# EAGLE design MIDI-Patchbay-Shield (EAGLE 8.4.2)
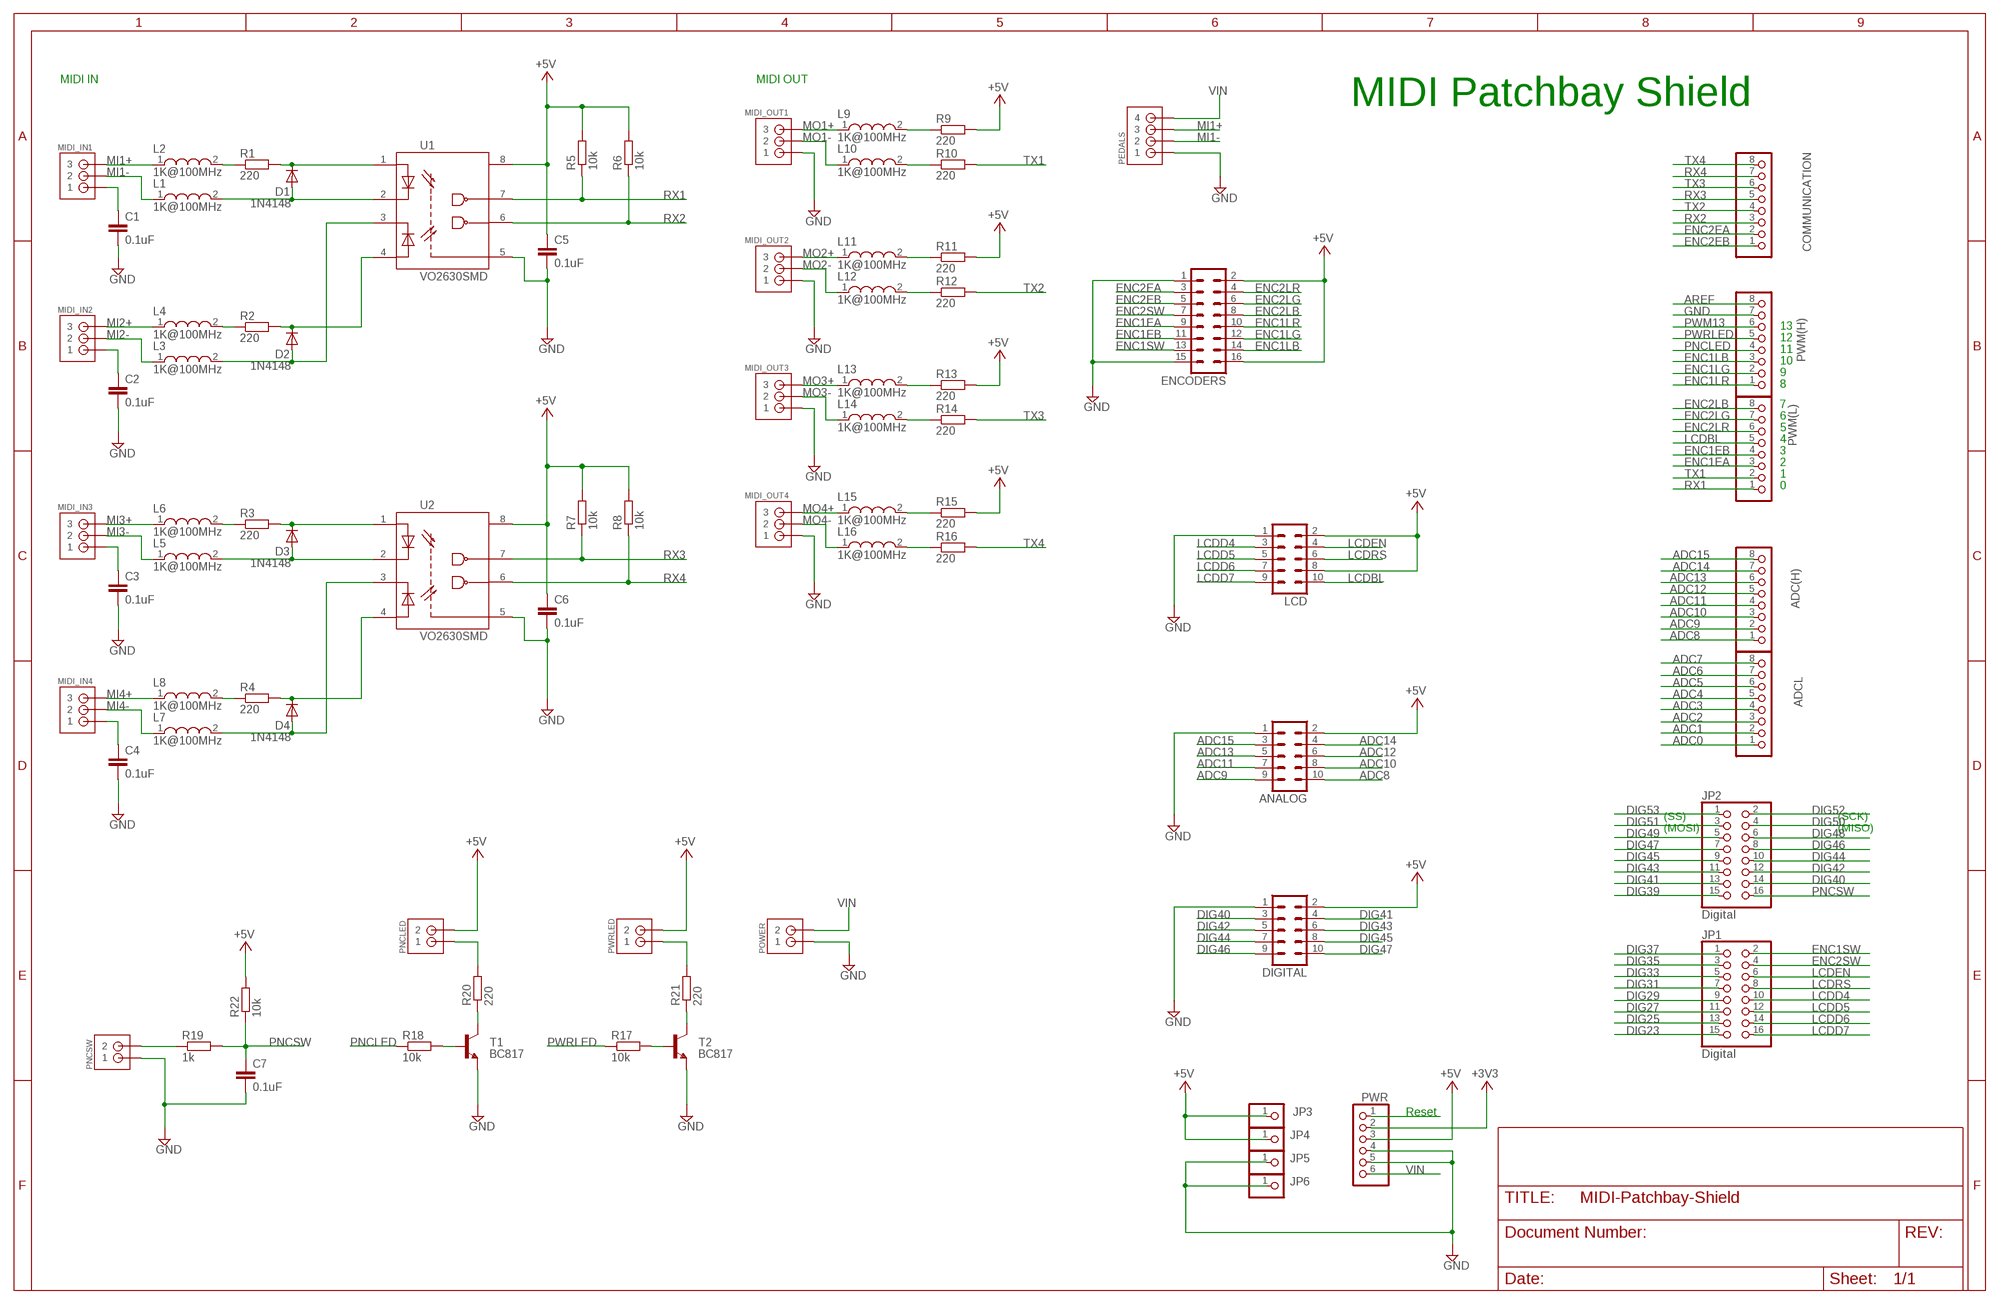
[diagram p0: schematic, sheet 1]

## Parts
ADC(H)  PINHD-1X8  [1X08]
ADCL  PINHD-1X8  [1X08]
ANALOG  ML10  [ML10]
C1  0.1uF  CAP0805  [0805]
C2  0.1uF  CAP0805  [0805]
C3  0.1uF  CAP0805  [0805]
C4  0.1uF  CAP0805  [0805]
C5  0.1uF  C-EUC0805  [C0805]
C6  0.1uF  C-EUC0805  [C0805]
C7  0.1uF  CAP0805  [0805]
COMMUNICATION  PINHD-1X8  [1X08]
D1  1N4148  [SOD323-W]
D2  1N4148  [SOD323-W]
D3  1N4148  [SOD323-W]
D4  1N4148  [SOD323-W]
DIGITAL  ML10  [ML10]
ENCODERS  ML16  [ML16]
JP1  Digital  PINHD-2X8  [2X08]
JP2  Digital  PINHD-2X8  [2X08]
JP3  PINHD-1X1  [1X01]
JP4  PINHD-1X1  [1X01]
JP5  PINHD-1X1  [1X01]
JP6  PINHD-1X1  [1X01]
L1  1K@100MHz  WE-RFI_0805  [WE-RFI_0805]
L2  1K@100MHz  WE-RFI_0805  [WE-RFI_0805]
L3  1K@100MHz  WE-RFI_0805  [WE-RFI_0805]
L4  1K@100MHz  WE-RFI_0805  [WE-RFI_0805]
L5  1K@100MHz  WE-RFI_0805  [WE-RFI_0805]
L6  1K@100MHz  WE-RFI_0805  [WE-RFI_0805]
L7  1K@100MHz  WE-RFI_0805  [WE-RFI_0805]
L8  1K@100MHz  WE-RFI_0805  [WE-RFI_0805]
L9  1K@100MHz  WE-RFI_0805  [WE-RFI_0805]
L10  1K@100MHz  WE-RFI_0805  [WE-RFI_0805]
L11  1K@100MHz  WE-RFI_0805  [WE-RFI_0805]
L12  1K@100MHz  WE-RFI_0805  [WE-RFI_0805]
L13  1K@100MHz  WE-RFI_0805  [WE-RFI_0805]
L14  1K@100MHz  WE-RFI_0805  [WE-RFI_0805]
L15  1K@100MHz  WE-RFI_0805  [WE-RFI_0805]
L16  1K@100MHz  WE-RFI_0805  [WE-RFI_0805]
LCD  ML10  [ML10]
MIDI_IN1  JST-XA-03-PIN  [JST-XA-03]
MIDI_IN2  JST-XA-03-PIN  [JST-XA-03]
MIDI_IN3  JST-XA-03-PIN  [JST-XA-03]
MIDI_IN4  JST-XA-03-PIN  [JST-XA-03]
MIDI_OUT1  JST-XA-03-PIN  [JST-XA-03]
MIDI_OUT2  JST-XA-03-PIN  [JST-XA-03]
MIDI_OUT3  JST-XA-03-PIN  [JST-XA-03]
MIDI_OUT4  JST-XA-03-PIN  [JST-XA-03]
PEDALS  JST-XA-04-PIN  [JST-XA-04]
PNCLED  JST-XA-02-PIN  [JST-XA-02]
PNCSW  JST-XA-02-PIN  [JST-XA-02]
POWER  JST-XA-02-PIN  [JST-XA-02]
PWM(H)  PINHD-1X8  [1X08]
PWM(L)  PINHD-1X8  [1X08]
PWR  PINHD-1X6  [1X06]
PWRLED  JST-XA-02-PIN  [JST-XA-02]
R1  220  R-EU_M0805  [M0805]
R2  220  R-EU_M0805  [M0805]
R3  220  R-EU_M0805  [M0805]
R4  220  R-EU_M0805  [M0805]
R5  10k  R-EU_R0805  [R0805]
R6  10k  R-EU_R0805  [R0805]
R7  10k  R-EU_R0805  [R0805]
R8  10k  R-EU_R0805  [R0805]
R9  220  R-EU_M0805  [M0805]
R10  220  R-EU_M0805  [M0805]
R11  220  R-EU_M0805  [M0805]
R12  220  R-EU_M0805  [M0805]
R13  220  R-EU_M0805  [M0805]
R14  220  R-EU_M0805  [M0805]
R15  220  R-EU_M0805  [M0805]
R16  220  R-EU_M0805  [M0805]
R17  10k  R-EU_R0805  [R0805]
R18  10k  R-EU_R0805  [R0805]
R19  1k  R-EU_R0805  [R0805]
R20  220  R-EU_M0805  [M0805]
R21  220  R-EU_M0805  [M0805]
R22  10k  R-EU_R0805  [R0805]
T1  BC817  [SOT23]
T2  BC817  [SOT23]
U1  VO2630SMD  [SOIC254P1030X390-8N]
U2  VO2630SMD  [SOIC254P1030X390-8N]

## Nets
+3V3 [power]: PWR.2
+5V [usbvcc]: ANALOG.2 C5.1 C6.1 DIGITAL.2 ENCODERS.2 ENCODERS.16 JP3.1 JP4.1 LCD.2 LCD.8 PNCLED.2 PWR.3 PWRLED.2 R5.2 R6.2 R7.2 R8.2 R9.2 R11.2 R13.2 R15.2 R22.2 U1.8(VCC) U2.8(VCC)
ADC0: ADCL.1
ADC1: ADCL.2
ADC2: ADCL.3
ADC3: ADCL.4
ADC4: ADCL.5
ADC5: ADCL.6
ADC6: ADCL.7
ADC7: ADCL.8
ADC8: ADC(H).1 ANALOG.10
ADC9: ADC(H).2 ANALOG.9
ADC10: ADC(H).3 ANALOG.8
ADC11: ADC(H).4 ANALOG.7
ADC12: ADC(H).5 ANALOG.6
ADC13: ADC(H).6 ANALOG.5
ADC14: ADC(H).7 ANALOG.4
ADC15: ADC(H).8 ANALOG.3
AREF: PWM(H).8
DIG23: JP1.15
DIG25: JP1.13
DIG27: JP1.11
DIG29: JP1.9
DIG31: JP1.7
DIG33: JP1.5
DIG35: JP1.3
DIG37: JP1.1
DIG39: JP2.15
DIG40: DIGITAL.3 JP2.14
DIG41: DIGITAL.4 JP2.13
DIG42: DIGITAL.5 JP2.12
DIG43: DIGITAL.6 JP2.11
DIG44: DIGITAL.7 JP2.10
DIG45: DIGITAL.8 JP2.9
DIG46: DIGITAL.9 JP2.8
DIG47: DIGITAL.10 JP2.7
DIG48: JP2.6
DIG49: JP2.5
DIG50: JP2.4
DIG51: JP2.3
DIG52: JP2.2
DIG53: JP2.1
ENC1EA: ENCODERS.9 PWM(L).3
ENC1EB: ENCODERS.11 PWM(L).4
ENC1LB: ENCODERS.14 PWM(H).3
ENC1LG: ENCODERS.12 PWM(H).2
ENC1LR: ENCODERS.10 PWM(H).1
ENC1SW: ENCODERS.13 JP1.2
ENC2EA: COMMUNICATION.2 ENCODERS.3
ENC2EB: COMMUNICATION.1 ENCODERS.5
ENC2LB: ENCODERS.8 PWM(L).8
ENC2LG: ENCODERS.6 PWM(L).7
ENC2LR: ENCODERS.4 PWM(L).6
ENC2SW: ENCODERS.7 JP1.4
GND [gnd]: ANALOG.1 C1.2 C2.2 C3.2 C4.2 C5.2 C6.2 C7.2 DIGITAL.1 ENCODERS.1 ENCODERS.15 JP5.1 JP6.1 LCD.1 MIDI_OUT1.1 MIDI_OUT2.1 MIDI_OUT3.1 MIDI_OUT4.1 PEDALS.1 PNCSW.1 POWER.1 PWM(H).7 PWR.4 PWR.5 T1.2(E) T2.2(E) U1.5(GND) U2.5(GND)
IC1: D1.C R1.2 U1.1(A1)
IC2: D2.C R2.2 U1.4(A2)
IC3: D3.C R3.2 U2.1(A1)
IC4: D4.C R4.2 U2.4(A2)
LCDBL: LCD.10 PWM(L).5
LCDD4: JP1.10 LCD.3
LCDD5: JP1.12 LCD.5
LCDD6: JP1.14 LCD.7
LCDD7: JP1.16 LCD.9
LCDEN: JP1.6 LCD.4
LCDRS: JP1.8 LCD.6
MI1+: L2.1 MIDI_IN1.3 PEDALS.3
MI1-: L1.1 MIDI_IN1.2 PEDALS.2
MI2+: L4.1 MIDI_IN2.3
MI2-: L3.1 MIDI_IN2.2
MI3+: L6.1 MIDI_IN3.3
MI3-: L5.1 MIDI_IN3.2
MI4+: L8.1 MIDI_IN4.3
MI4-: L7.1 MIDI_IN4.2
MO1+: L9.1 MIDI_OUT1.3
MO1-: L10.1 MIDI_OUT1.2
MO2+: L11.1 MIDI_OUT2.3
MO2-: L12.1 MIDI_OUT2.2
MO3+: L13.1 MIDI_OUT3.3
MO3-: L14.1 MIDI_OUT3.2
MO4+: L15.1 MIDI_OUT4.3
MO4-: L16.1 MIDI_OUT4.2
N$2: R17.2 T2.1(B)
N$3: C1.1 MIDI_IN1.1
N$4: L2.2 R1.1
N$5: R18.2 T1.1(B)
N$6: D1.A L1.2 U1.2(C1)
N$8: L9.2 R9.1
N$9: L10.2 R10.1
N$10: R20.1 T1.3(C)
N$12: L4.2 R2.1
N$13: D2.A L3.2 U1.3(C2)
N$14: C2.1 MIDI_IN2.1
N$15: R21.1 T2.3(C)
N$16: PNCSW.2 R19.1
N$17: L6.2 R3.1
N$18: D3.A L5.2 U2.2(C1)
N$19: C3.1 MIDI_IN3.1
N$22: L8.2 R4.1
N$23: D4.A L7.2 U2.3(C2)
N$24: C4.1 MIDI_IN4.1
N$27: L11.2 R11.1
N$28: L12.2 R12.1
N$31: L13.2 R13.1
N$32: L14.2 R14.1
N$35: L15.2 R15.1
N$36: L16.2 R16.1
PNCLED: PWM(H).4 R18.1
PNCLED-: PNCLED.1 R20.2
PNCSW: C7.1 JP2.16 R19.2 R22.1
PWM13: PWM(H).6
PWRLED: PWM(H).5 R17.1
PWRLED-: PWRLED.1 R21.2
RESET: PWR.1
RX1: PWM(L).1 R5.1 U1.7(VO1)
RX2: COMMUNICATION.3 R6.1 U1.6(VO2)
RX3: COMMUNICATION.5 R7.1 U2.7(VO1)
RX4: COMMUNICATION.7 R8.1 U2.6(VO2)
TX1: PWM(L).2 R10.2
TX2: COMMUNICATION.4 R12.2
TX3: COMMUNICATION.6 R14.2
TX4: COMMUNICATION.8 R16.2
VIN [power]: PEDALS.4 POWER.2 PWR.6

## Notes on the sheet
- MIDI IN | MIDI OUT
- MIDI Patchbay Shield
- 13
- 12
- 11
- 10
- 9
- 8
- 7
- 6
- 5
- 4
- 3
- 2
- 1
- 0
- (SS) | (SCK)
- (MOSI) | (MISO)
- Reset

## Library data of the parts
ADC(H) ADCL COMMUNICATION PWM(H) PWM(L) = pinhead:PINHD-1X8: PIN HEADER
ANALOG DIGITAL LCD = con-ml:ML10: HARTING; OC_FARNELL: unknown; OC_NEWARK: unknown
C1-C4 C7 = SparkFun-Capacitors:CAP: Capacitor Standard 0603 ceramic capacitor, and 0.1" leaded capacitor.
C5 C6 = rcl:C-EU: CAPACITOR, European symbol
D1-D4 = abw:1N4148: DIODE high speed (Philips)
ENCODERS = con-harting-ml:ML16: HARTING; OC_FARNELL: unknown; OC_NEWARK: unknown
JP1 JP2 = pinhead:PINHD-2X8: PIN HEADER
JP3-JP6 = pinhead:PINHD-1X1: PIN HEADER
L1-L16 = abw:WE-RFI: Ferrite SMD Inductor Characteristics High thermal stability Operating temperature: –40 °C to +85 °C Applications Especially developed for RF applications RFID Low frequency radio applications (Keyless) <http://katalog.we-online.de/media/images/eisos/RfRFI_pf2.jpg> Details see: http://katalog.we-online.de/en/pbs/WE-RFI? Updated by Dan Xu 2014-07-08 2014 (C) Wurth Elektronik
MIDI_IN1-MIDI_IN4 MIDI_OUT1-MIDI_OUT4 = abw:JST-XA-03-PIN: JST XA Connector 3 Pin Wire to board connector. Pitch: 2.54 mm, (0.100") Number of pins: 3
PEDALS = abw:JST-XA-04-PIN: JST XH Connector 2 Pin Wire to board connector. Pitch: 2,54 mm, (0.100") Number of pins: 4 Created by Rembrandt Electronics www.rembrandtelectronics.com
PNCLED PNCSW POWER PWRLED = abw:JST-XA-02-PIN: JST XA Connector 2 Pin Wire to board connector. Pitch: 2.54 mm, (0.100") Number of pins: 2
PWR = pinhead:PINHD-1X6: PIN HEADER
R1-R16 R20 R21 = resistor:R-EU_: RESISTOR, European symbol
R17-R19 R22 = resistor:R-EU_: RESISTOR, European symbol; SPICEPREFIX: R
T1 T2 = abw:BC817: General purpose NPN transistor SMD
U1 U2 = abw:VO2630

## Net classes
0 default: width 0.203 mm, drill 0.406 mm, clearance 0.203 mm
1 power: width 0.61 mm, drill 0.711 mm, clearance 0.203 mm
2 gnd: width 0.305 mm, drill 0.711 mm, clearance 0.203 mm
3 usbvcc: width 0.508 mm, drill 0.711 mm, clearance 0.203 mm

## Board
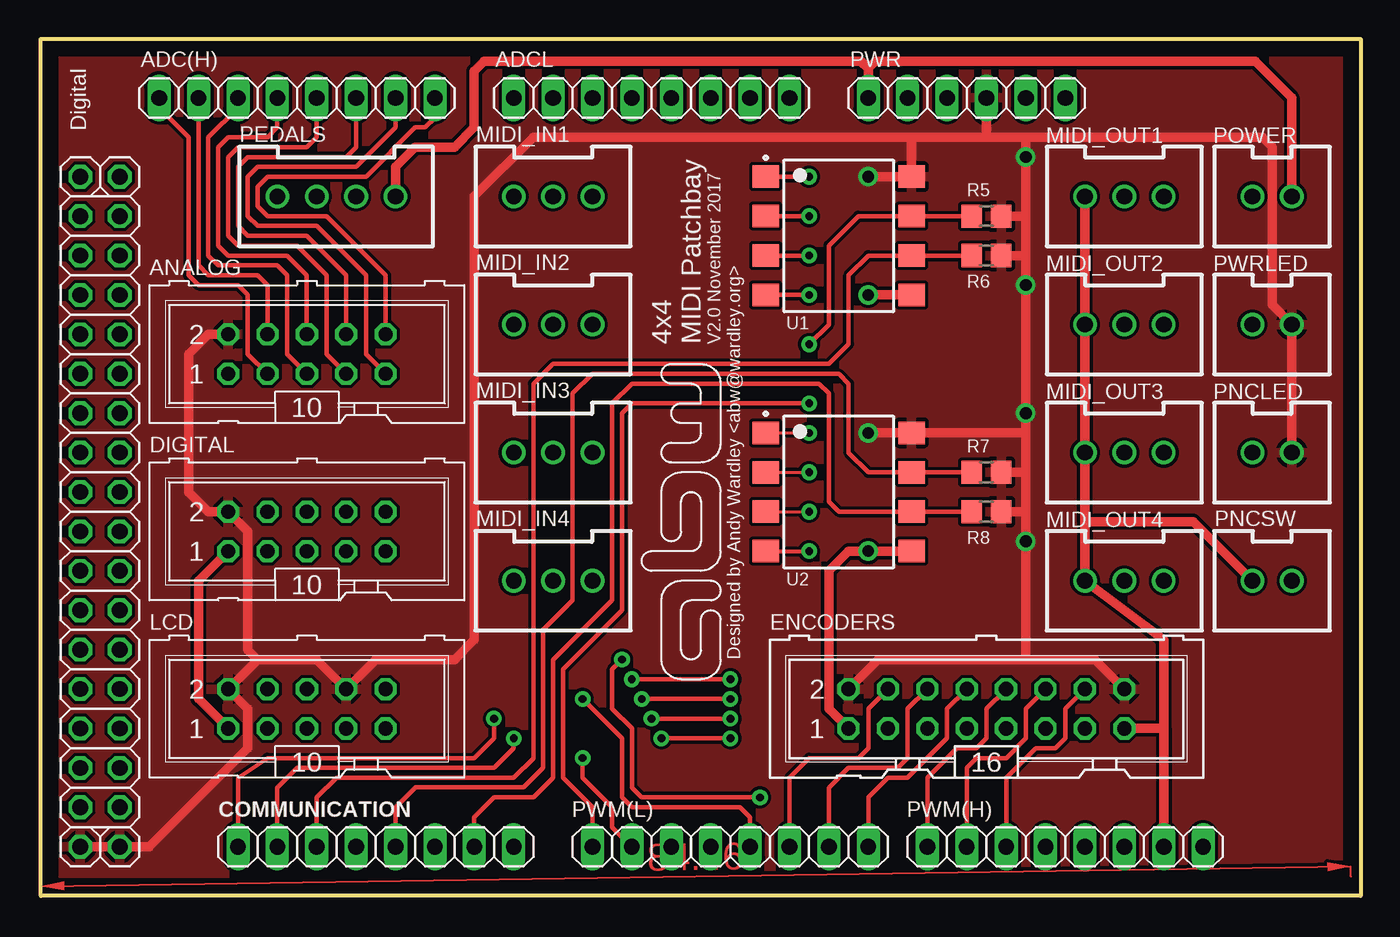
[diagram p1: board, top side]
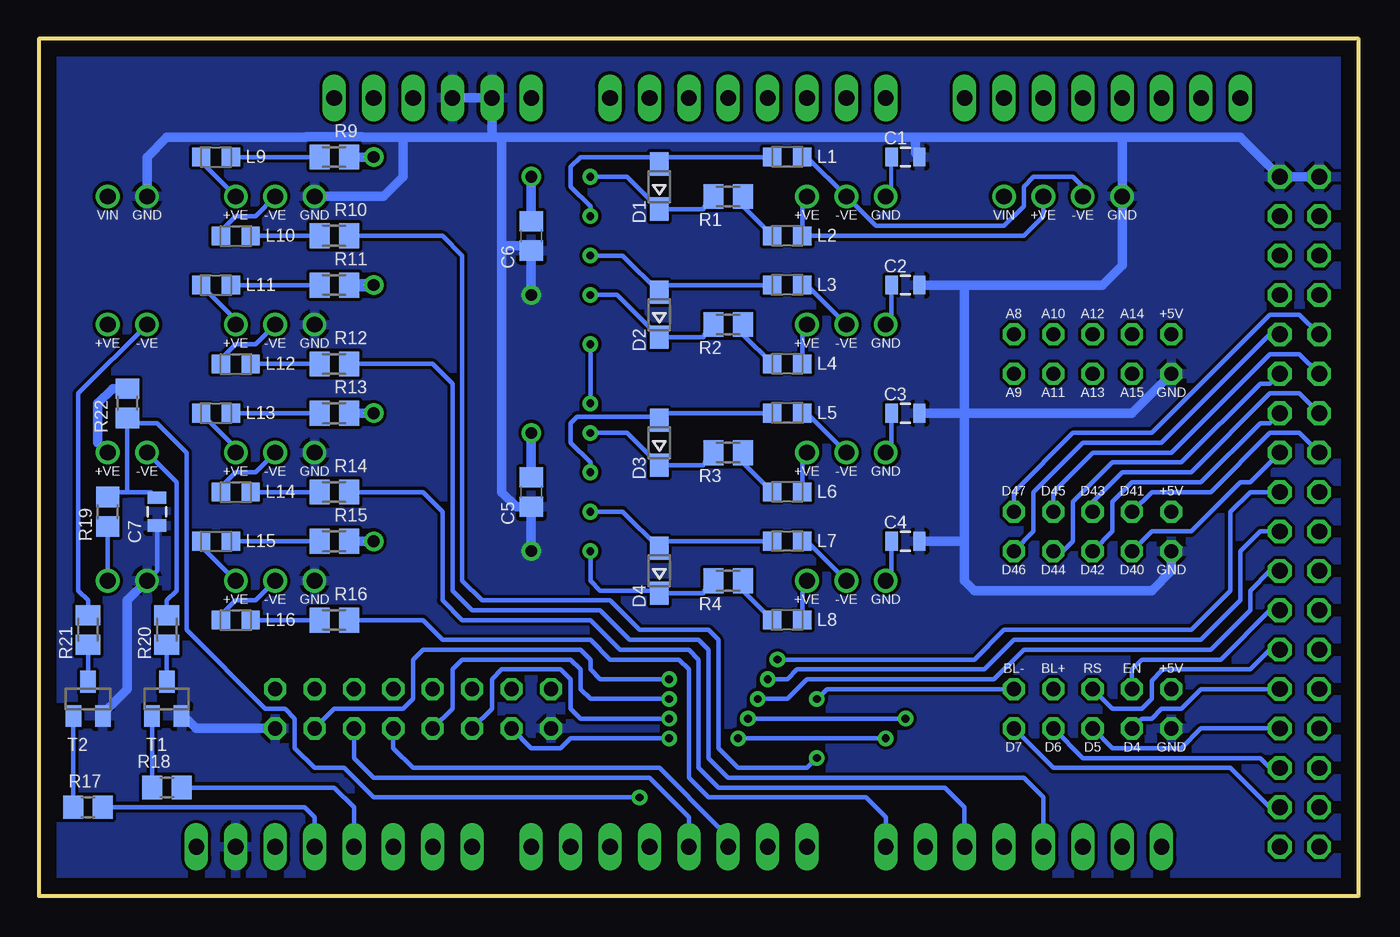
[diagram p2: board, bottom side, seen from below]

Size 85.09 x 55.24 mm. Coordinates in mm from the lower left corner, seen from the top.
Outline: 85.09,0 0,0 0,55.24 85.09,55.24 85.09,0
Copper layers (1*16): Top 0.035mm / dielectric 1.5mm / Bottom 0.035mm
Design rules "default *": minimum track width 8mil, minimum drill 16mil, track to track 8mil, track to pad 8mil, pad to pad 8mil, via to via 10mil, smd to smd 8mil, copper to edge 40mil, drill to drill 12mil, minimum pad ring 10mil, minimum via ring 10mil, stop-mask expansion 4mil, vias tented up to drill 0mil, thermal gap 10mil

### Footprints (pad centres in the part's own frame; a part is rotated, then mirrored left to right if it is on the bottom)
1X08 = drill 1.016 long: 1 -8.89,0; 2 -6.35,0; 3 -3.81,0; 4 -1.27,0; 5 1.27,0; 6 3.81,0; 7 6.35,0; 8 8.89,0
ML10 = drill 0.914 octagon: 1 -5.08,-1.27; 2 -5.08,1.27; 3 -2.54,-1.27; 4 -2.54,1.27; 5 0,-1.27; 6 0,1.27; 7 2.54,-1.27; 8 2.54,1.27; 9 5.08,-1.27; 10 5.08,1.27
0805 = smd 0.8 x 1.2: 1 -0.9,0; 2 0.9,0
C0805 = smd 1.3 x 1.5: 1 -0.95,0; 2 0.95,0
SOD323-W = smd 1.5 x 1.2: A 1.45,0; C -1.45,0
ML16 = drill 0.914 octagon: 1 -8.89,-1.27; 2 -8.89,1.27; 3 -6.35,-1.27; 4 -6.35,1.27; 5 -3.81,-1.27; 6 -3.81,1.27; 7 -1.27,-1.27; 8 -1.27,1.27; 9 1.27,-1.27; 10 1.27,1.27; 11 3.81,-1.27; 12 3.81,1.27; 13 6.35,-1.27; 14 6.35,1.27; 15 8.89,-1.27; 16 8.89,1.27
2X08 = drill 1.016 octagon: 1 -8.89,-1.27; 2 -8.89,1.27; 3 -6.35,-1.27; 4 -6.35,1.27; 5 -3.81,-1.27; 6 -3.81,1.27; 7 -1.27,-1.27; 8 -1.27,1.27; 9 1.27,-1.27; 10 1.27,1.27; 11 3.81,-1.27; 12 3.81,1.27; 13 6.35,-1.27; 14 6.35,1.27; 15 8.89,-1.27; 16 8.89,1.27
1X01 = drill 1.016 octagon: 1 0,0
WE-RFI_0805 = smd 1.179 x 1.2: 1 -0.965,0; 2 0.965,0
JST-XA-03 = drill 1.016: 1 -2.54,0; 2 0,0; 3 2.54,0
JST-XA-04 = drill 1.016: 1 -2.54,0; 2 0,0; 3 2.54,0; 4 5.08,0
JST-XA-02 = drill 1.016: 1 -2.54,0; 2 0,0
1X06 = drill 1.016 long: 1 -6.35,0; 2 -3.81,0; 3 -1.27,0; 4 1.27,0; 5 3.81,0; 6 6.35,0
M0805 = smd 1.3 x 1.6: 1 -0.95,0; 2 0.95,0
R0805 = smd 1.3 x 1.5: 1 -0.95,0; 2 0.95,0
SOT23 = smd 1 x 1.4: 1 -0.95,-1.1; 2 0.95,-1.1; 3 0,1.1
SOIC254P1030X390-8N = smd 1.7 x 1.45: 1 -4.7,3.81; 2 -4.7,1.27; 3 -4.7,-1.27; 4 -4.7,-3.81; 5 4.7,-3.81; 6 4.7,-1.27; 7 4.7,1.27; 8 4.7,3.81

### Placement (x,y rotation side)
ADC(H)  16.51,51.43 180 top
ADCL  39.37,51.43 180 top
ANALOG  17.14,34.92 0 top
C1  29.21,47.62 0 bottom
C2  29.21,39.37 0 bottom
C3  29.21,31.11 0 bottom
C4  29.21,22.86 0 bottom
C5  53.34,26.04 270 bottom
C6  53.34,42.54 270 bottom
C7  77.47,24.77 270 bottom
COMMUNICATION  21.59,3.18 0 top
D1  45.09,45.72 90 bottom
D2  45.09,37.46 90 bottom
D3  45.09,29.21 90 bottom
D4  45.09,20.96 90 bottom
DIGITAL  17.14,23.5 0 top
ENCODERS  60.96,12.07 0 top
JP1  3.81,14.61 270 top
JP2  3.81,34.92 270 top
JP3  5.08,3.18 180 top
JP4  2.54,3.18 180 top
JP5  5.08,46.35 180 top
JP6  2.54,46.35 180 top
L1  36.83,47.62 180 bottom
L2  36.83,42.54 180 bottom
L3  36.83,39.37 180 bottom
L4  36.83,34.29 180 bottom
L5  36.83,31.11 180 bottom
L6  36.83,26.04 180 bottom
L7  36.83,22.86 180 bottom
L8  36.83,17.78 180 bottom
L9  73.66,47.62 0 bottom
L10  72.39,42.54 0 bottom
L11  73.66,39.37 0 bottom
L12  72.39,34.29 0 bottom
L13  73.66,31.11 0 bottom
L14  72.39,26.04 0 bottom
L15  73.66,22.86 0 bottom
L16  72.39,17.78 0 bottom
LCD  17.14,12.07 0 top
MIDI_IN1  33.02,45.08 0 top
MIDI_IN2  33.02,36.83 0 top
MIDI_IN3  33.02,28.57 0 top
MIDI_IN4  33.02,20.32 0 top
MIDI_OUT1  69.85,45.08 0 top
MIDI_OUT2  69.85,36.83 0 top
MIDI_OUT3  69.85,28.57 0 top
MIDI_OUT4  69.85,20.32 0 top
PEDALS  17.78,45.08 0 top
PNCLED  80.65,28.57 0 top
PNCSW  80.65,20.32 0 top
POWER  80.65,45.08 0 top
PWM(H)  66.04,3.18 0 top
PWM(L)  44.45,3.18 0 top
PWR  59.69,51.43 180 top
PWRLED  80.65,36.83 0 top
R1  40.64,45.08 180 bottom
R2  40.64,36.83 180 bottom
R3  40.64,28.57 180 bottom
R4  40.64,20.32 180 bottom
R5  60.96,43.81 0 top
R6  60.96,41.27 0 top
R7  60.96,27.3 0 top
R8  60.96,24.77 0 top
R9  66.04,47.62 0 bottom
R10  66.04,42.54 0 bottom
R11  66.04,39.37 0 bottom
R12  66.04,34.29 0 bottom
R13  66.04,31.11 0 bottom
R14  66.04,26.04 0 bottom
R15  66.04,22.86 0 bottom
R16  66.04,17.78 0 bottom
R17  81.91,5.71 180 bottom
R18  76.84,6.99 180 bottom
R19  80.65,24.77 90 bottom
R20  76.84,17.14 90 bottom
R21  81.91,17.14 90 bottom
R22  79.38,31.75 90 bottom
T1  76.84,12.7 0 bottom
T2  81.91,12.7 0 bottom
U1  51.44,42.54 0 top
U2  51.44,26.04 0 top
U$1  [ABWLOGO-MICRO]  41.91,24.13 90 top

### Tracks (layer width: path | path; a pad name or v marks a point on that pad's centre or on a via)
+5V  (via drill 0.75)
  Top 0.61: v53.34,29.84 U2.8 63.5,29.84 | JP4.1 JP3.1 6.98,3.18 13.34,9.53 13.34,12.07 LCD.2 13.97,15.24 | 60.96,48.89 55.88,48.89 | 60.96,48.89 63.5,48.89 | 55.88,48.89 31.75,48.89 27.94,45.08 27.94,16.51 26.67,15.24 21.59,15.24 LCD.8 17.78,15.24 13.97,15.24 | 63.5,27.3 63.5,24.77 | 63.5,41.27 63.5,43.81 | 63.5,29.84 v63.5,31.11 v63.5,39.37 63.5,41.27 | 63.5,29.84 63.5,27.3 | 63.5,43.81 v63.5,47.62 63.5,48.89 | 63.5,24.77 v63.5,22.86 63.5,15.24 | R8.2 63.5,24.77 | R7.2 63.5,27.3 | R5.2 63.5,43.81 | R6.2 63.5,41.27 | 55.88,48.89 56.13,48.64 U1.8 v53.34,46.35 | ANALOG.2 10.79,36.2 9.53,34.92 9.53,26.04 10.79,24.77 DIGITAL.2 13.34,23.5 13.34,15.88 13.97,15.24 | PWR.3 60.96,48.89 | 63.5,48.89 78.74,48.89 79.38,48.26 79.38,38.1 PWRLED.2 PNCLED.2 | ENCODERS.16 67.94,15.24 63.5,15.24 | 63.5,15.24 53.98,15.24 ENCODERS.2
  Bottom 0.61: C5.1 v53.34,29.84 | C6.1 v53.34,46.35 | R13.2 v63.5,31.11 | R15.2 v63.5,22.86 | R9.2 v63.5,47.62 | 79.69,32.7 R22.2 80.33,32.7 81.28,31.75 81.28,29.21 PNCLED.2
  Bottom 0.813: R11.2 v63.5,39.37
  pour Top: 0,55.24 85.09,55.24 85.09,0 0,0
ADC8
  Top 0.305: ADC(H).1 25.4,50.16 24.77,49.53 24.13,49.53 20.95,46.35 14.61,46.35 13.97,45.72 13.97,44.45 14.61,43.81 18.41,43.81 22.23,40 ANALOG.10
ADC9
  Top 0.305: ANALOG.9 20.95,34.92 20.95,40 17.78,43.18 13.97,43.18 13.34,43.81 13.34,46.35 13.97,46.99 20.32,46.99 22.86,49.53 ADC(H).2
ADC10
  Top 0.305: ADC(H).3 20.32,48.26 19.68,47.62 13.34,47.62 12.7,46.99 12.7,43.18 13.34,42.54 17.14,42.54 19.68,40 ANALOG.8
ADC11
  Top 0.305: ADC(H).4 17.78,48.89 17.14,48.26 12.7,48.26 12.07,47.62 12.07,42.54 12.7,41.91 16.51,41.91 18.41,40 18.41,34.92 ANALOG.7
ADC12
  Top 0.305: ADC(H).5 15.24,49.53 14.61,48.89 12.07,48.89 11.43,48.26 11.43,41.91 12.07,41.27 15.88,41.27 17.14,40 ANALOG.6
ADC13
  Top 0.305: ANALOG.5 15.88,34.92 15.88,40 15.24,40.64 11.43,40.64 10.79,41.27 10.79,48.89 12.7,50.8 ADC(H).6
ADC14
  Top 0.305: ANALOG.4 14.61,39.37 13.97,40 10.79,40 10.16,40.64 ADC(H).7
ADC15
  Top 0.305: ADC(H).8 7.62,50.8 9.53,48.89 9.53,40 10.16,39.37 12.7,39.37 13.34,38.73 13.34,34.92 ANALOG.3
DIG40
  Bottom 0.305: JP2.14 6.98,26.67 7.62,26.67 10.79,23.5 13.34,23.5 DIGITAL.3
DIG41
  Bottom 0.305: JP2.13 3.81,29.84 5.71,29.84 9.53,26.04 13.34,26.04 DIGITAL.4
DIG42
  Bottom 0.305: JP2.12 5.71,30.48 6.35,30.48 10.16,26.67 14.61,26.67 15.88,25.4 15.88,23.5 DIGITAL.5
DIG43
  Bottom 0.305: JP2.11 3.81,32.38 5.71,32.38 10.79,27.3 15.24,27.3 17.14,25.4 DIGITAL.6
DIG44
  Bottom 0.305: JP2.10 5.71,33.02 6.35,33.02 11.43,27.94 15.88,27.94 18.41,25.4 18.41,22.86 19.05,22.23 DIGITAL.7
DIG45
  Bottom 0.305: JP2.9 3.81,34.92 5.71,34.92 12.07,28.57 17.14,28.57 19.68,26.04 DIGITAL.8
DIG46
  Bottom 0.305: JP2.8 5.71,36.2 12.7,29.21 17.78,29.21 20.95,26.04 20.95,23.5 DIGITAL.9
DIG47
  Bottom 0.305: JP2.7 3.81,37.46 5.71,37.46 13.34,29.84 18.41,29.84 22.23,26.04 DIGITAL.10
ENC1EA
  Bottom 0.305: PWM(L).3 40.64,4.45 41.27,4.45 45.09,8.26 60.96,8.26 62.23,9.53 ENCODERS.9
ENC1EB
  Bottom 0.305: PWM(L).4 43.18,5.08 45.72,7.62 63.5,7.62 64.77,8.89 ENCODERS.11
ENC1LB
  Top 0.305: PWM(H).3 62.23,7.62 64.13,9.53 65.41,9.53 66.04,10.16 66.04,12.07 ENCODERS.14
ENC1LG
  Top 0.305: ENCODERS.12 63.5,12.07 63.5,10.16 62.23,8.89 60.32,8.89 59.69,8.26 PWM(H).2
ENC1LR
  Top 0.305: ENCODERS.10 60.96,12.07 60.96,10.16 60.32,9.53 59.05,9.53 57.15,7.62 PWM(H).1
ENC1SW  (via drill 0.5)
  Top 0.305: v38.1,13.97 v44.45,13.97
  Bottom 0.305: ENCODERS.13 66.04,12.07 61.6,12.07 60.96,12.7 60.96,15.24 60.32,15.88 50.16,15.88 49.53,15.24 49.53,14.61 48.9,13.97 v44.45,13.97 | JP1.2 6.35,23.5 7.62,22.23 7.62,19.05 10.16,16.51 22.23,16.51 24.13,14.61 36.2,14.61 36.83,13.97 v38.1,13.97
ENC2EA  (via drill 0.5)
  Top 0.305: COMMUNICATION.2 15.24,6.99 16.51,8.26 29.21,8.26 30.48,9.53 v30.48,10.16 | v40.01,10.16 v44.45,10.16
  Bottom 0.305: v30.48,10.16 v40.01,10.16 | ENCODERS.3 53.34,9.53 51.44,9.53 50.8,10.16 v44.45,10.16
ENC2EB  (via drill 0.5)
  Top 0.305: COMMUNICATION.1 12.7,7.62 14.61,8.89 27.94,8.89 29.21,10.16 v29.21,11.43 | v39.37,11.43 v44.45,11.43
  Bottom 0.305: v29.21,11.43 v39.37,11.43 | ENCODERS.5 55.88,12.07 55.88,13.97 55.24,14.61 51.44,14.61 50.8,13.97 50.8,12.07 50.16,11.43 v44.45,11.43
ENC2LB
  Top 0.305: PWM(L).8 53.34,6.35 54.61,7.62 55.88,7.62 58.42,10.16 58.42,12.07 ENCODERS.8
ENC2LG
  Top 0.305: PWM(L).7 50.8,6.99 52.07,8.26 55.24,8.26 55.88,8.89 55.88,12.07 ENCODERS.6
ENC2LR
  Top 0.305: PWM(L).6 48.26,7.62 49.53,8.89 52.7,8.89 53.34,9.53 53.34,12.07 ENCODERS.4
ENC2SW  (via drill 0.5)
  Top 0.305: v38.73,12.7 v44.45,12.7
  Bottom 0.305: ENCODERS.7 58.42,12.07 58.42,14.61 57.78,15.24 50.8,15.24 50.16,14.61 50.16,13.34 49.53,12.7 v44.45,12.7 | JP1.4 5.71,20.96 6.98,19.68 6.98,18.41 9.53,15.88 21.59,15.88 23.5,13.97 35.56,13.97 36.83,12.7 v38.73,12.7
GND  (via drill 0.75)
  Top 0.61: U2.5 v53.34,22.23 52.07,22.23 50.8,20.96 50.8,12.07 ENCODERS.1 | 67.31,24.13 MIDI_OUT4.1 72.39,16.51 72.39,10.79 | 67.31,24.13 MIDI_OUT3.1 MIDI_OUT2.1 MIDI_OUT1.1 | U1.5 v53.34,38.73 | 72.39,10.79 PWM(H).7 | ENCODERS.15 72.39,10.79 | PNCSW.1 74.29,24.13 67.31,24.13 | LCD.1 10.16,12.7 10.16,20.32 DIGITAL.1
  Bottom 0.305: PNCSW.1 77.47,20.96 C7.2
  Bottom 0.61: v53.34,22.23 C5.2 54.3,25.09 55.24,26.04 55.24,41.91 | PWR.4 PWR.5 55.88,48.89 | JP6.1 JP5.1 7.62,48.89 15.24,48.89 | v53.34,38.73 C6.2 53.66,41.91 55.24,41.91 | 61.6,48.89 55.88,48.89 | 28.58,48.89 15.24,48.89 | 55.88,48.89 55.24,48.89 | 15.24,48.89 PEDALS.1 15.24,40.64 16.51,39.37 25.4,39.37 | 55.24,41.91 55.24,48.89 | MIDI_OUT1.1 62.87,45.08 61.6,46.35 61.6,48.89 | C1.2 28.58,47.89 28.58,48.89 | ANALOG.1 14.61,31.11 25.4,31.11 | 25.4,22.86 25.4,20.32 24.77,19.68 13.34,19.68 12.07,20.96 DIGITAL.1 | C4.2 25.4,22.86 | 25.4,39.37 C2.2 | 55.24,48.89 28.58,48.89 | 61.6,48.89 64.19,48.89 64.23,48.93 67.85,48.93 67.89,48.89 76.84,48.89 78.1,47.62 POWER.1 | 25.4,31.11 25.4,22.86 | 25.4,31.11 25.4,39.37 | 25.4,31.11 C3.2 | T2.2 80.97,11.75 79.38,13.34 79.38,19.05 PNCSW.1 | ENCODERS.15 74.93,10.79 75.74,11.6 T1.2
  pour Bottom: 0,55.24 85.09,55.24 85.09,0 0,0
IC1  (via drill 0.5)
  Top 0.305: U1.1 v49.53,46.35
  Bottom 0.305: R1.2 arc-45 42.24,44.27 D1.C 47.17,46.35 v49.53,46.35
IC2  (via drill 0.5)
  Top 0.305: U1.4 v49.53,38.73
  Bottom 0.305: R2.2 arc-45 42.24,36.01 D2.C 47.8,38.73 v49.53,38.73
IC3  (via drill 0.5)
  Top 0.203: U2.1 v49.53,29.84
  Bottom 0.254: R3.2 arc-45 42.24,27.76
  Bottom 0.305: 42.24,27.76 D3.C 47.17,29.84 v49.53,29.84
IC4  (via drill 0.5)
  Top 0.254: U2.4 v49.53,22.23
  Bottom 0.254: D4.C 45.27,19.68
  Bottom 0.305: D4.C 42.24,19.5 arc45 R4.2 | 45.27,19.68 48.9,19.68 49.53,20.32 v49.53,22.23
LCDBL  (via drill 0.5)
  Top 0.305: PWM(L).5 45.72,5.08 45.09,5.71 38.1,5.71 37.46,6.35 37.46,10.16 v34.92,12.7
  Bottom 0.305: v34.92,12.7 34.29,13.34 LCD.10
LCDD4
  Bottom 0.305: LCD.3 13.97,11.43 13.34,11.43 12.7,12.07 11.43,12.07 10.16,13.34 JP1.10
LCDD5
  Bottom 0.305: LCD.5 15.88,9.53 11.43,9.53 10.16,10.79 JP1.12
LCDD6
  Bottom 0.305: LCD.7 17.78,8.89 6.35,8.89 5.71,8.26 JP1.14
LCDD7
  Bottom 0.305: LCD.9 19.68,8.26 8.25,8.26 5.71,5.71 JP1.16
LCDEN
  Bottom 0.305: JP1.6 5.71,18.41 8.89,15.24 13.97,15.24 14.61,14.61 LCD.4
LCDRS
  Bottom 0.305: LCD.6 15.88,12.07 13.97,12.07 13.34,12.7 13.34,13.89 12.7,14.52 12.7,14.61 6.98,14.61 5.71,15.88 JP1.8
MI1+
  Bottom 0.305: MIDI_IN1.3 35.87,44.78 L2.1 21.59,42.54 20.32,43.81 PEDALS.3
MI1-
  Bottom 0.254: 35.56,47.62 L1.1
  Bottom 0.305: 35.56,47.62 MIDI_IN1.2 31.12,43.18 22.86,43.18 21.59,44.45 21.59,45.72 20.95,46.35 18.41,46.35 17.78,45.72 PEDALS.2
MI2+
  Bottom 0.305: MIDI_IN2.3 35.87,36.52 L4.1
MI2-
  Bottom 0.305: MIDI_IN2.2 35.56,39.37 L3.1
MI3+
  Bottom 0.305: MIDI_IN3.3 35.87,28.27 L6.1
MI3-
  Bottom 0.254: 35.56,31.11 L5.1
  Bottom 0.305: MIDI_IN3.2 35.56,31.11
MI4+
  Bottom 0.305: MIDI_IN4.3 35.87,20.02 L8.1
MI4-
  Bottom 0.254: 35.56,22.86 L7.1
  Bottom 0.305: MIDI_IN4.2 35.56,22.86
MO1+
  Bottom 0.305: MIDI_OUT1.3 74.62,47.32 L9.1
MO1-
  Bottom 0.305: MIDI_OUT1.2 71.12,43.81 72.39,43.81 73.59,42.61 73.64,42.61 L10.1
MO2+
  Bottom 0.305: MIDI_OUT2.3 72.39,37.14 L11.1
MO2-
  Bottom 0.305: MIDI_OUT2.2 71.12,35.56 72.39,35.56 73.59,34.36 73.64,34.36 L12.1
MO3+
  Bottom 0.305: MIDI_OUT3.3 72.39,28.88 L13.1
MO3-
  Bottom 0.305: MIDI_OUT3.2 71.12,27.3 72.39,27.3 73.35,26.34 L14.1
MO4+
  Bottom 0.305: MIDI_OUT4.3 74.62,22.55 L15.1
MO4-
  Bottom 0.305: MIDI_OUT4.2 71.12,19.05 72.39,19.05 73.35,18.09 L16.1
N$2
  Bottom 0.305: R17.2 T2.1
N$3
  Bottom 0.254: MIDI_IN1.1 30.11,45.45 C1.1
N$4
  Bottom 0.305: L2.2 39.69,44.44 R1.1
N$5
  Bottom 0.305: R18.2 T1.1
N$6  (via drill 0.5)
  Top 0.305: U1.2 v49.53,43.81
  Bottom 0.305: L1.2 44.63,47.62 45.14,47.11 | v49.53,43.81 49.53,44.45 50.8,45.72 50.8,46.99 50.16,47.62 45.65,47.62 45.14,47.11 | D1.A 45.14,47.11
N$8
  Bottom 0.305: R9.1 L9.2
N$9
  Bottom 0.305: L10.2 R10.1
N$10
  Bottom 0.305: T1.3 R20.1
N$12
  Bottom 0.305: L4.2 39.69,36.19 R2.1
N$13  (via drill 0.5)
  Top 0.305: U1.3 v49.53,41.27
  Bottom 0.254: 44.63,39.37 D2.A
  Bottom 0.305: D2.A 47.45,41.27 v49.53,41.27 | L3.2 44.63,39.37
N$14
  Bottom 0.305: MIDI_IN2.1 30.11,37.2 C2.1
N$15
  Bottom 0.305: T2.3 R21.1
N$16
  Bottom 0.305: PNCSW.2 R19.1
N$17
  Bottom 0.305: L6.2 39.69,27.93 R3.1
N$18  (via drill 0.5)
  Top 0.203: U2.2 v49.53,27.3
  Bottom 0.254: D3.A 44.86,30.89 44.63,31.11
  Bottom 0.305: L5.2 44.63,31.11 | v49.53,27.3 49.53,27.94 50.8,29.21 50.8,30.48 50.39,30.89 44.86,30.89
N$19
  Bottom 0.305: MIDI_IN3.1 30.11,28.95 C3.1
N$22
  Bottom 0.254: 39.69,19.68 R4.1
  Bottom 0.305: L8.2 39.69,19.68
N$23  (via drill 0.5)
  Top 0.203: U2.3 v49.53,24.77
  Bottom 0.254: 44.63,22.86 D4.A
  Bottom 0.305: D4.A 47.45,24.77 v49.53,24.77 | L7.2 44.63,22.86
N$24
  Bottom 0.305: MIDI_IN4.1 30.11,20.69 C4.1
N$27
  Bottom 0.305: L11.2 R11.1
N$28
  Bottom 0.305: L12.2 R12.1
N$31
  Bottom 0.305: L13.2 R13.1
N$32
  Bottom 0.305: L14.2 R14.1
N$35
  Bottom 0.305: R15.1 L15.2
N$36
  Bottom 0.305: L16.2 R16.1
PNCLED
  Bottom 0.305: PWM(H).4 64.77,5.71 66.04,6.99 R18.1
PNCLED-
  Bottom 0.305: R20.2 76.84,19.05 76.2,19.68 76.2,26.67 PNCLED.1
PNCSW  (via drill 0.5)
  Top 0.305: v37.46,15.24 36.83,14.61 36.83,12.07 38.1,10.79 38.1,6.99 38.73,6.35 v46.35,6.35
  Bottom 0.305: JP2.16 6.98,26.04 8.25,24.77 8.25,19.68 10.79,17.14 22.86,17.14 24.77,15.24 v37.46,15.24 | v46.35,6.35 63.5,6.35 65.41,8.26 67.31,8.26 68.58,9.53 68.58,11.43 69.22,12.07 70.49,12.07 75.56,17.14 75.56,22.11 75.57,22.11 75.57,28.58 77.47,30.48 79.38,30.48 | 79.38,30.48 R22.1 | 79.38,30.48 79.38,26.04 | C7.1 77.84,26.04 79.38,26.04 | R19.2 80.32,26.04 79.38,26.04
PWRLED
  Bottom 0.305: PWM(H).5 67.31,5.08 67.94,5.71 R17.1
PWRLED-
  Bottom 0.305: R21.2 81.91,19.05 82.55,19.68 82.55,32.38 PWRLED.1
RX1  (via drill 0.5)
  Top 0.305: v49.53,31.75 38.1,31.75 37.46,31.11 37.46,18.41 33.66,14.61 33.66,7.62 35.56,5.71 PWM(L).1 | v49.53,35.56 50.8,36.83 50.8,41.91 52.7,43.81 U1.7 R5.1
  Bottom 0.305: v49.53,35.56 v49.53,31.75
RX2
  Top 0.305: R6.1 U1.6 53.34,41.27 52.07,40 52.07,35.56 50.8,34.29 33.02,34.29 31.75,33.02 31.75,8.89 30.48,7.62 19.05,7.62 17.78,6.35 COMMUNICATION.3
RX3
  Top 0.305: R7.1 U2.7 53.34,27.3 52.07,28.57 52.07,33.02 51.44,33.65 35.56,33.65 34.29,32.38 34.29,19.05 32.38,17.14 32.38,8.26 31.13,7 24.14,7 22.86,5.71 COMMUNICATION.5
RX4
  Top 0.305: R8.1 U2.6 51.44,24.77 50.8,25.4 50.8,32.38 50.16,33.02 38.1,33.02 36.83,31.75 36.83,19.05 33.02,15.24 33.02,7.62 31.75,6.35 29.21,6.35 27.94,5.08 COMMUNICATION.7
TX1  (via drill 0.5)
  Top 0.305: PWM(L).2 36.83,4.45 36.83,5.71 34.92,7.62 v34.92,8.89
  Bottom 0.305: R10.2 59.05,42.54 57.78,41.27 57.78,20.32 56.52,19.05 48.26,19.05 46.35,17.14 41.91,17.14 41.27,16.51 41.27,9.53 40.01,8.26 35.56,8.26 v34.92,8.89
TX2
  Bottom 0.305: COMMUNICATION.4 20.32,6.35 21.59,7.62 40.64,7.62 41.91,8.89 41.91,15.88 42.55,16.51 46.99,16.51 48.9,18.41 57.15,18.41 58.42,19.68 58.42,33.02 59.69,34.29 R12.2
TX3
  Bottom 0.305: COMMUNICATION.6 25.4,5.71 26.67,6.99 41.27,6.99 42.55,8.26 42.55,15.24 43.18,15.88 47.62,15.88 49.53,17.78 57.78,17.78 59.05,19.05 59.05,24.77 60.32,26.04 R14.2
TX4
  Bottom 0.305: COMMUNICATION.8 30.48,5.08 31.75,6.35 41.91,6.35 43.18,7.62 43.18,14.61 43.81,15.24 48.26,15.24 49.53,16.51 59.05,16.51 60.32,17.78 R16.2 64.77,17.78
VIN
  Top 0.61: PWR.6 53.34,53.34 | 53.34,53.34 53.8,53.8 78.28,53.8 80.65,51.43 POWER.2 | 53.34,53.34 52.88,53.8 28.58,53.8 27.94,53.16 27.94,49.53 26.67,48.26 24.13,48.26 22.86,46.99 PEDALS.4
(copper drawn outside any net)
  shapes: Top area x1

### Text on the board
tPlace: 4x4 / MIDI Patchbay | V2.0 November 2017 | Designed by Andy Wardley <abw@wardley.org>
bPlace: GND | -VE | +VE | VIN | GND | -VE | +VE | GND | -VE | +VE | GND | VIN | +5V | A14 | A12 | A10 | A8 | GND | -VE | +VE | GND | -VE | +VE | -VE | +VE | GND | A15 | A13 | A11 | A9 | GND | -VE | +VE | GND | -VE | +VE | -VE | +VE | +5V | D41 | D43 | D45 | D47 | GND | D40 | D42 | D44 | D46 | GND | -VE | +VE | GND | -VE | +VE | +5V | EN | RS | BL+ | BL- | GND | D4 | D5 | D6 | D7